# EasyEDA Pro project ProPrj_Framethrower_Denise_Rev1.epro

# Schematic Schematic1
Board Name: Board1; Create Date: 2025-08-25; Page Name: P1; Project Name: Framethrower_Denise_2; Schematic Name: Schematic1; Update Date: 2025-08-30; Company: EasyEDA.com; Page Size: A4; Version: V1.0
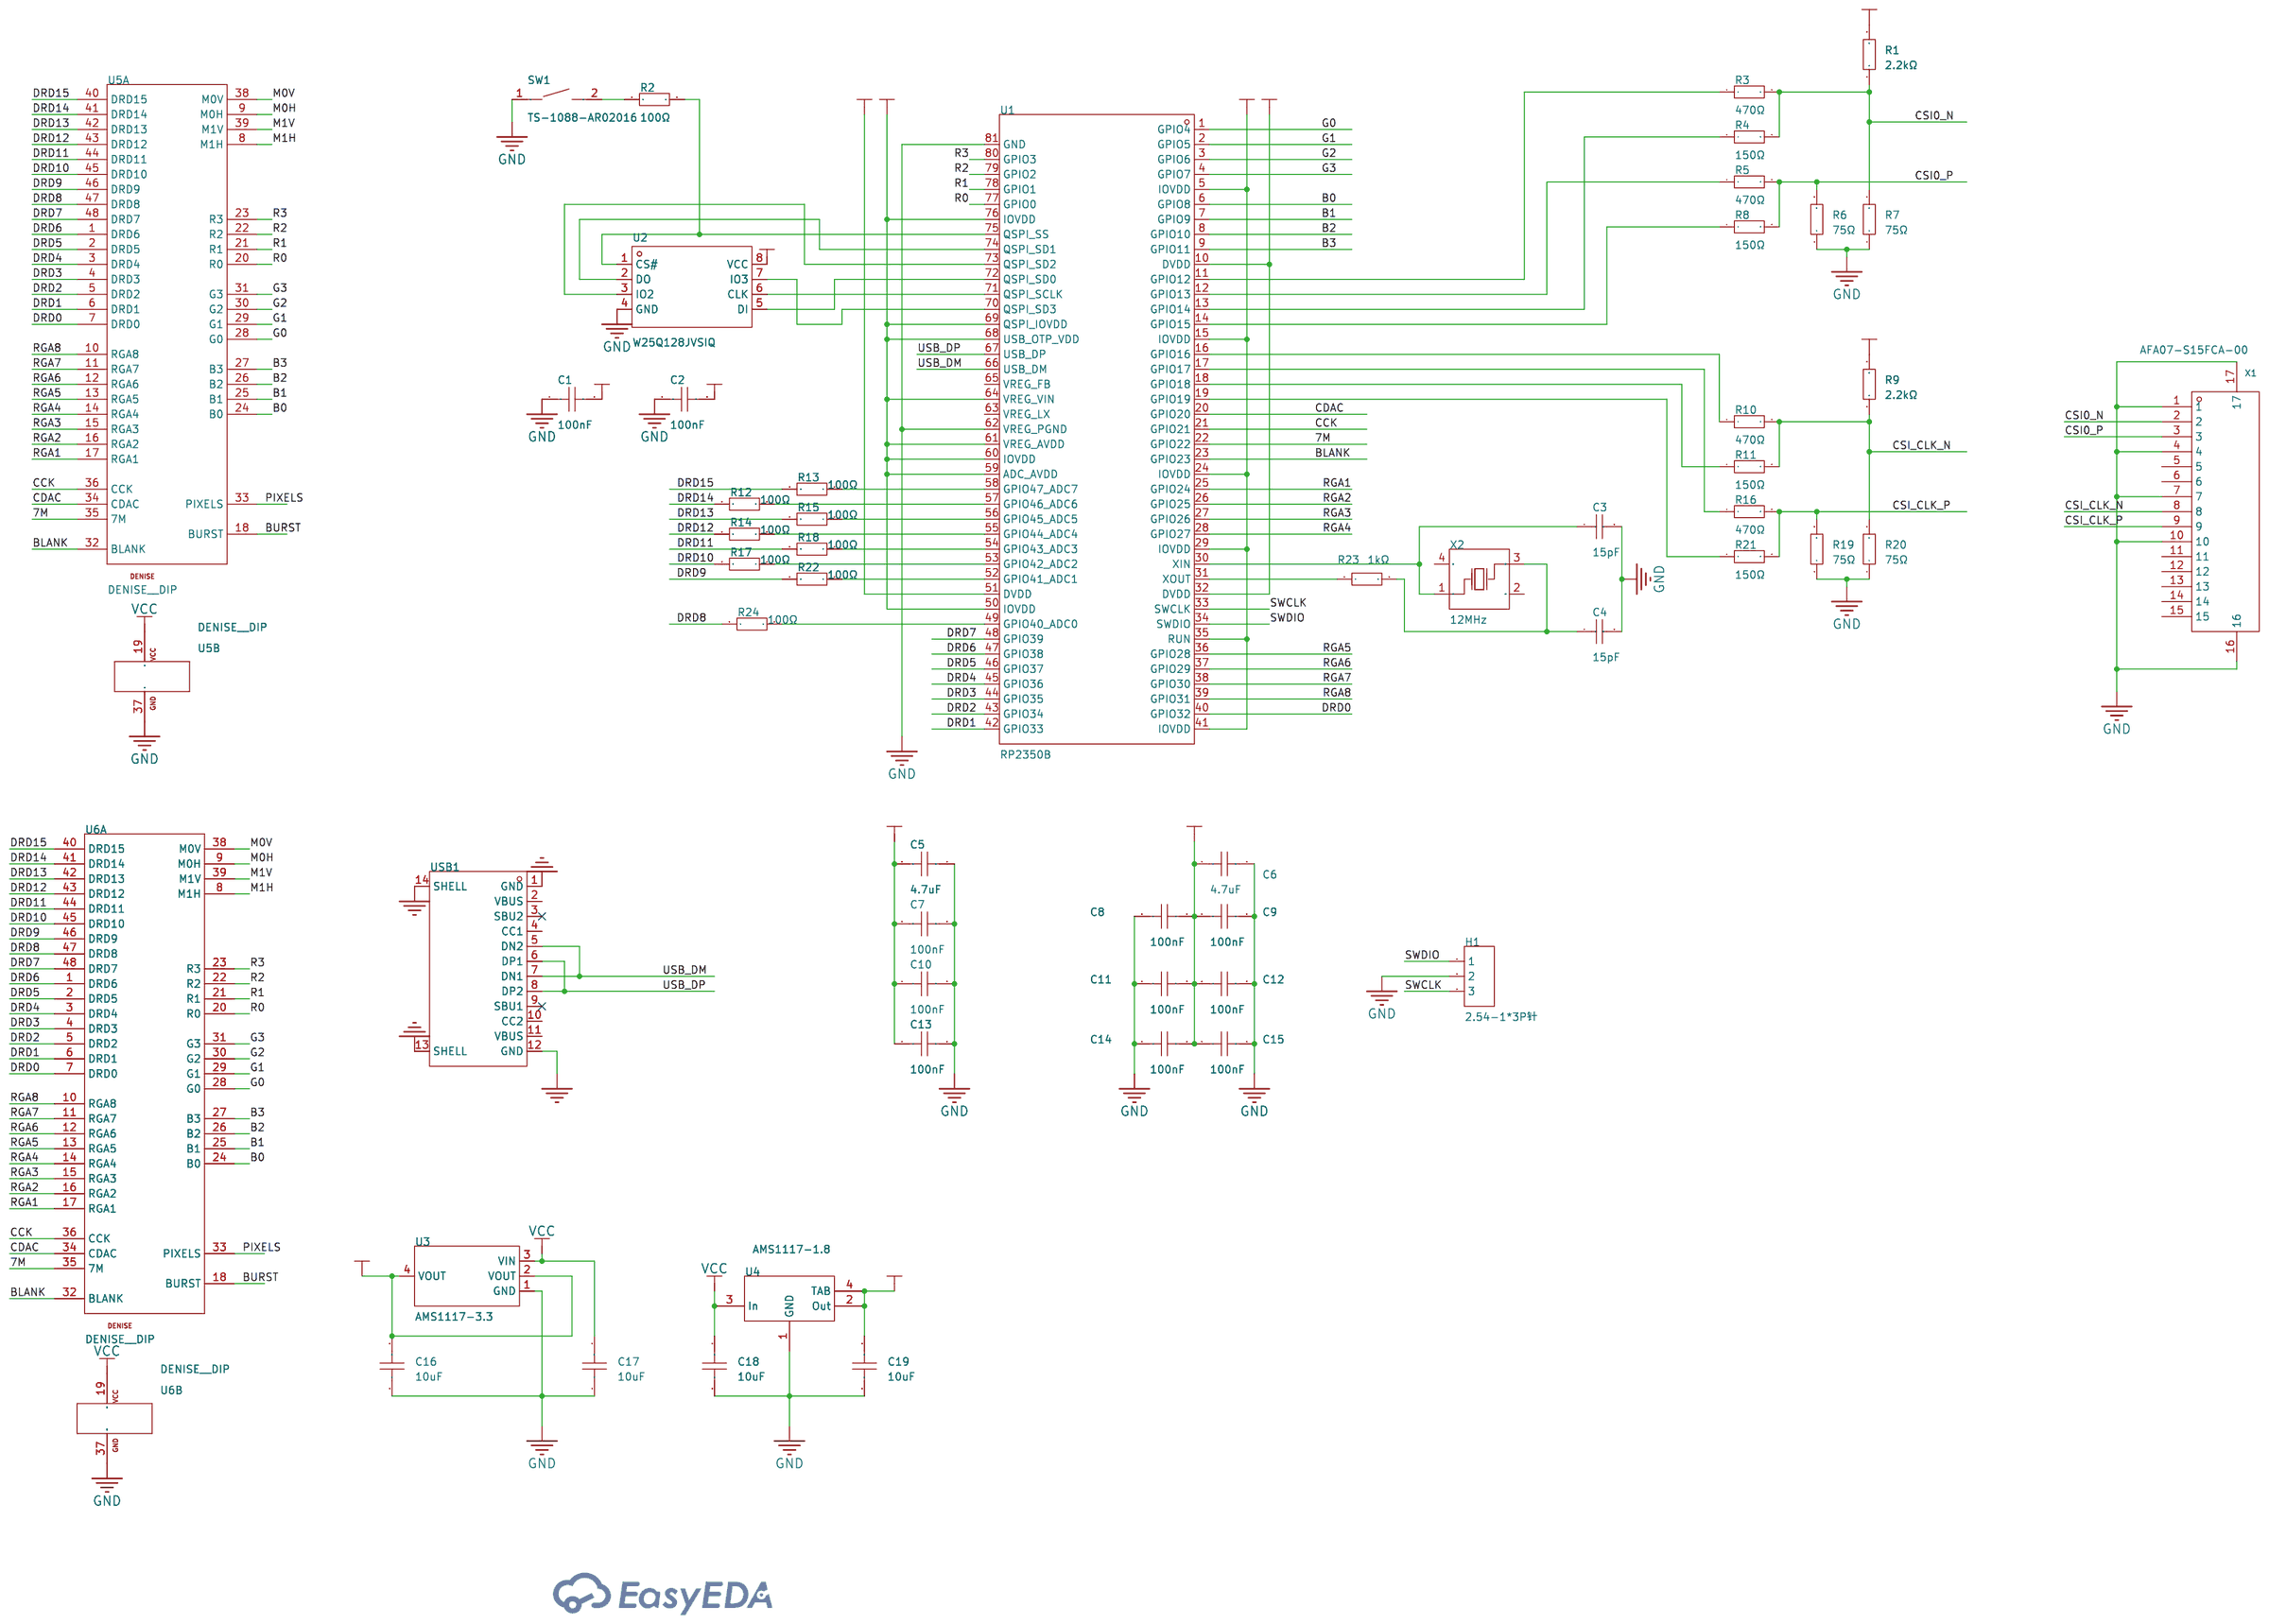
[diagram p0: schematic sheet]

## Parts
C1  100nF  [C0603]
C2  100nF  [C0603]
C3  15pF  [C0603]
C4  15pF  [C0603]
C5  4.7uF  [C0603]
C6  4.7uF  [C0603]
C7  100nF  [C0603]
C8  100nF  [C0603]
C9  100nF  [C0603]
C10  100nF  [C0603]
C11  100nF  [C0603]
C12  100nF  [C0603]
C13  100nF  [C0603]
C14  100nF  [C0603]
C15  100nF  [C0603]
C16  10uF  [C0603]
C17  10uF  [C0603]
C18  10uF  [C0603]
C19  10uF  [C0603]
H1  2.54-1*3P针  [HDR-TH_3P-P2.54-V-M-1]  (no BOM)
R1  2.2kΩ  [R0603]
R2  100Ω  [R0603]
R3  470Ω  [R0603]
R4  150Ω  [R0603]
R5  470Ω  [R0603]
R6  75Ω  [R0603]
R7  75Ω  [R0603]
R8  150Ω  [R0603]
R9  2.2kΩ  [R0603]
R10  470Ω  [R0603]
R11  150Ω  [R0603]
R12  100Ω  [R0603]
R13  100Ω  [R0603]
R14  100Ω  [R0603]
R15  100Ω  [R0603]
R16  470Ω  [R0603]
R17  100Ω  [R0603]
R18  100Ω  [R0603]
R19  75Ω  [R0603]
R20  75Ω  [R0603]
R21  150Ω  [R0603]
R22  100Ω  [R0603]
R23  1kΩ  [R0603]
R24  100Ω  [R0603]
SW1  TS-1088-AR02016  [SW-SMD_L3.9-W3.0-P4.45]
U1  RP2350B  [QFN-80_L10.0-W10.0-P0.40-TL-EP3.4]
U2  W25Q128JVSIQ  [SOIC-8_L5.3-W5.3-P1.27-LS8.0-BL]
U3  AMS1117-3.3  [SOT-223-3_L6.5-W3.4-P2.30-LS7.0-BR]
U4  AMS1117-1.8  [SOT-223-4_L6.5-W3.5-P2.30-LS7.0-BR]
U5  DENISE__DIP  [DIP48-6]  (sections G$1,PWR)
U6  DENISE__DIP  [DIP48-6]  (sections G$1,PWR)
USB1  TYPE-C 16PIN 2MD(073)  [USB-C-SMD_TYPE-C-6PIN-2MD-073]
X1  AFA07-S15FCA-00  [FPC-SMD_15P-P1.00_JS_AFA07-S15XXX]
X2  12MHz  [CRYSTAL-SMD_4P-L3.2-W2.5-BL]

## Library data of the parts
C1 C2 C7-C15 = CC0603KRX7R9BB104: Capacitance:100nF Tolerance:±10% Tolerance:±10% Voltage Rating:50V Temperature Coefficient:X7R; LCSC Part Name: 100nF ±10% 50V; Supplier Part: C14663; Manufacturer: YAGEO(国巨); Supplier Footprint: 0603; JLCPCB Part Class: Basic Part; Datasheet: https://atta.szlcsc.com/upload/public/pdf/source/20180910/C282072_33301C7F631E79921B82A8DAC6BCC5B3.pdf; Supplier: LCSC; Tolerance: ±10%; Voltage Rating: 50V; Temperature Coefficient: X7R
C3 C4 = CL10C150JB8NNNC: Capacitance: Tolerance:±5% Tolerance:±5% Voltage Rated: Temperature Coefficient:; LCSC Part Name: 15pF ±5% 50V; Supplier Part: C1644; Manufacturer: SAMSUNG(三星); Supplier Footprint: 0603; JLCPCB Part Class: Basic Part; Datasheet: https://atta.szlcsc.com/upload/public/pdf/source/20160218/1457707763339.pdf; Supplier: LCSC; Tolerance: ±5%
C5 C6 = CL10A475KO8NNNC: Capacitance: Tolerance:±10% Tolerance:±10% Voltage Rated: Temperature Coefficient:; LCSC Part Name: 4.7uF ±10% 16V; Supplier Part: C19666; Manufacturer: SAMSUNG(三星); Supplier Footprint: 0603; JLCPCB Part Class: Basic Part; Datasheet: https://atta.szlcsc.com/upload/public/pdf/source/20160218/1457707763339.pdf; Supplier: LCSC; Tolerance: ±10%
C16-C19 = CL10A106KP8NNNC: Capacitance: Tolerance:±10% Tolerance:±10% Voltage Rated: Temperature Coefficient:; LCSC Part Name: 10uF ±10% 10V; Supplier Part: C19702; Manufacturer: SAMSUNG(三星); Supplier Footprint: 0603; JLCPCB Part Class: Basic Part; Datasheet: https://atta.szlcsc.com/upload/public/pdf/source/20160218/1457707763339.pdf; Supplier: LCSC; Tolerance: ±10%
H1 = 2.54-1*3P针: Pin Structure:1x3P Pitch:2.54mm Row Spacing:- Circluar Pins/Square Pins:Policy Mounting Type:Direct Insert Number of Rows:Single Row Number of Pins:3P Current Rating (Max):3A Voltage Rating (Max):- Length of Mating Pin:- Insulation Height:- Length of End; LCSC Part Name: 间距:2.54mm 1x3P 直插 方针; Supplier Part: C49257; Manufacturer: BOOMELE(博穆精密); Supplier Footprint: 插件,P=2.54mm; JLCPCB Part Class: Extended Part; Datasheet: https://atta.szlcsc.com/upload/public/pdf/source/20221018/3E9408392E35E6F57A28985E5F7BF5C9.pdf; Supplier: LCSC; Pin Structure: 1x3P; Pitch: 2.54mm; Circluar Pins/Square Pins: Policy; Mounting Type: Direct Insert; Number of Rows: Single Row; Number of Pins: 3P; Current Rating (Max): 3A; Operating Temperature Range: -40℃~+105℃; Color: Black
R1 R9 = 0603WAF2201T5E_C4190: Type:Thick Film Resistors Resistance:2.2kΩ Tolerance:±1% Tolerance:±1% Power(Watts): Overload Voltage (Max): Temperature Coefficient:±100ppm/℃ Temperature Coefficient:±100ppm/℃ Operating Temperature Range:-55℃~+155℃ Operating Temperature Range:-55℃~+155℃; LCSC Part Name: 2.2kΩ ±1% 100mW 厚膜电阻; Supplier Part: C4190; Manufacturer: UNI-ROYAL(厚声); Manufacturer Part: 0603WAF2201T5E; Supplier Footprint: 0603; JLCPCB Part Class: Basic Part; Datasheet: https://atta.szlcsc.com/upload/public/pdf/source/20200306/C422600_1E6D84923E4A46A82E41ADD87F860B5C.pdf; Supplier: LCSC; Type: Thick Film Resistors; Tolerance: ±1%; Temperature Coefficient: ±100ppm/℃; Operating Temperature Range: -55℃~+155℃
R2 R12-R15 R17 R18 R22 R24 = 0603WAF1000T5E: Type:Thick Film Resistors Resistance: Tolerance:±1% Tolerance:±1% Power(Watts): Overload Voltage (Max): Temperature Coefficient:±200ppm/℃ Temperature Coefficient:±200ppm/℃ Operating Temperature Range:-55℃~+155℃ Operating Temperature Range:-55℃~+155℃; LCSC Part Name: 100Ω ±1% 100mW 厚膜电阻; Supplier Part: C22775; Manufacturer: UNI-ROYAL(厚声); Supplier Footprint: 0603; JLCPCB Part Class: Basic Part; Datasheet: https://atta.szlcsc.com/upload/public/pdf/source/20200306/C422600_1E6D84923E4A46A82E41ADD87F860B5C.pdf; Supplier: LCSC; Type: Thick Film Resistors; Tolerance: ±1%; Temperature Coefficient: ±200ppm/℃; Operating Temperature Range: -55℃~+155℃
R3 R5 R10 R16 = 0603WAF4700T5E: Type:Thick Film Resistor Resistance:470Ω Tolerance:±1% Tolerance:±1% Power(Watts):100mW Voltage-Supply(Max):75V Temperature Coefficient:±100ppm/℃ Temperature Coefficient:±100ppm/℃ Operating Temperature:-55℃~+155℃ Operating Temperature:-55℃~+155℃; LCSC Part Name: 470Ω ±1% 100mW 厚膜电阻; Supplier Part: C23179; Manufacturer: UNI-ROYAL(厚声); Supplier Footprint: 0603; JLCPCB Part Class: Basic Part; Datasheet: https://item.szlcsc.com/datasheet/0603WAF4700T5E/23906.html; Supplier: LCSC; Type: Thick Film Resistor; Tolerance: ±1%; Power(Watts): 100mW; Voltage-Supply(Max): 75V; Temperature Coefficient: ±100ppm/℃; Operating Temperature: -55℃~+155℃
R4 R8 R11 R21 = 0603WAF1500T5E: Type:Thick Film Resistors Resistance: Tolerance:±1% Tolerance:±1% Power(Watts): Overload Voltage (Max): Temperature Coefficient:±100ppm/℃ Temperature Coefficient:±100ppm/℃ Operating Temperature Range:-55℃~+155℃ Operating Temperature Range:-55℃~+155℃; LCSC Part Name: 150Ω ±1% 100mW 厚膜电阻; Supplier Part: C22808; Manufacturer: UNI-ROYAL(厚声); Supplier Footprint: 0603; JLCPCB Part Class: Basic Part; Datasheet: https://atta.szlcsc.com/upload/public/pdf/source/20200306/C422600_1E6D84923E4A46A82E41ADD87F860B5C.pdf; Supplier: LCSC; Type: Thick Film Resistors; Tolerance: ±1%; Temperature Coefficient: ±100ppm/℃; Operating Temperature Range: -55℃~+155℃
R6 R7 R19 R20 = 0603WAF750JT5E: Type:Thick Film Resistor Resistance:75Ω Tolerance:±1% Tolerance:±1% Power(Watts):100mW Voltage-Supply(Max):75V Temperature Coefficient:±100ppm/℃ Temperature Coefficient:±100ppm/℃ Operating Temperature:-55℃~+155℃ Operating Temperature:-55℃~+155℃; LCSC Part Name: 75Ω ±1% 100mW 厚膜电阻; Supplier Part: C4275; Manufacturer: UNI-ROYAL(厚声); Supplier Footprint: 0603; JLCPCB Part Class: Basic Part; Datasheet: https://item.szlcsc.com/datasheet/0603WAF750JT5E/4682.html; Supplier: LCSC; Type: Thick Film Resistor; Tolerance: ±1%; Power(Watts): 100mW; Temperature Coefficient: ±100ppm/℃; Operating Temperature Range: -55℃~+155℃; Voltage-Supply(Max): 75V; Operating Temperature: -55℃~+155℃
R23 = 0603WAF1001T5E: Type:Thick Film Resistors Resistance:1kΩ Tolerance:±1% Tolerance:±1% Power(Watts): Overload Voltage (Max): Temperature Coefficient:±100ppm/℃ Temperature Coefficient:±100ppm/℃ Operating Temperature Range:-55℃~+155℃ Operating Temperature Range:-55℃~+155℃; LCSC Part Name: 1kΩ ±1% 100mW 厚膜电阻; Supplier Part: C21190; Manufacturer: UNI-ROYAL(厚声); Supplier Footprint: 0603; JLCPCB Part Class: Basic Part; Datasheet: https://atta.szlcsc.com/upload/public/pdf/source/20200306/C422600_1E6D84923E4A46A82E41ADD87F860B5C.pdf; Supplier: LCSC; Type: Thick Film Resistors; Tolerance: ±1%; Temperature Coefficient: ±100ppm/℃; Operating Temperature Range: -55℃~+155℃
SW1 = TS-1088-AR02016: Circuit:SPST Actuator Style:Round Button Operating Force:160gf Mounting Style:Brick nogging Switch Length:4mm Switch Width:3mm Switch Height:2mm Strike Gundam:不带 Contact Current:50mA Voltage Rating (DC):12V Insulation Resistance:100MΩ Actuator/Cap Color:B; LCSC Part Name: 4*3*2mm 立贴 轻触开关; Supplier Part: C720477; Manufacturer: XUNPU(讯普); Supplier Footprint: SMD; JLCPCB Part Class: Basic Part; Datasheet: https://atta.szlcsc.com/upload/public/pdf/source/20200810/C720475_60D09DD6C54279ADDB2DC25100F1CC11.pdf; Supplier: LCSC; Circuit: SPST; Actuator Style: Round Button; Operating Force: 160gf; Mounting Style: Brick nogging; Switch Length: 4mm; Switch Width: 3mm; Switch Height: 2mm; Strike Gundam: 不带; Contact Current: 50mA; Voltage Rating (DC): 12V; Insulation Resistance: 100MΩ; Actuator/Cap Color: Black; Pin Style: SMDSplicing; Mechanical Life: 10万次; Operating Temperature: -30℃~+80℃
U1 = RP2350B_C42415655: Supplier Part: C42415655; Manufacturer: Raspberry Pi(树莓派); Supplier Footprint: QFN-80-EP(10x10); JLCPCB Part Class: Extended Part; Datasheet: https://atta.szlcsc.com/upload/public/pdf/source/20241210/0989AB86AAD7A21936E5CD12ADC9EA29.pdf; Supplier: LCSC
U2 = W25Q128JVSIQ: Interface Type:SPI Memory Size:128Mbit Clock Frequency (fc):133MHz Supply Voltage:2.7V~3.6V Supply Voltage:2.7V~3.6V Page Programming Time (Tpp):700us Block Erase Time (tBE):120ms@(32KB) Data Retention - TDR (Year):20 years Operating Temperature:-40℃~+85℃; LCSC Part Name: W25Q128JVSIQ 编带; Supplier Part: C97521; Manufacturer: WINBOND(华邦); Supplier Footprint: SOIC-8-208mil; JLCPCB Part Class: Basic Part; Datasheet: https://atta.szlcsc.com/upload/public/pdf/source/20170316/1489627409956.pdf; Supplier: LCSC; Interface Type: SPI; Memory Size: 128Mbit; Clock Frequency (fc): 133MHz; Supply Voltage: 2.7V~3.6V; Page Programming Time (Tpp): 700us; Block Erase Time (tBE): 120ms@(32KB); Data Retention - TDR (Year): 20 years; Operating Temperature: -40℃~+85℃
U3 = AMS1117-3.3_C6186: Output Type:Fixed Voltage - Supply:16V Output Voltage:3.3V Output Voltage:3.3V Output Current:1A Power Supply Rejection Ratio (PSRR):72dB@(120Hz) Voltage Dropout:1.1V@(800mA) standby current:5mA Noise:- Features:Over Current Protection；Over Temperature Pr; LCSC Part Name: 输出3.3V 1A; Supplier Part: C6186; Manufacturer: AMS; Supplier Footprint: SOT-223; JLCPCB Part Class: Basic Part; Datasheet: https://atta.szlcsc.com/upload/public/pdf/source/20180727/C6186_7A095716F0823C02F1997A905E26C086.pdf; Supplier: LCSC; Output Type: Fixed; Voltage - Supply: 16V; Output Voltage: 3.3V; Output Current: 1A; Power Supply Rejection Ratio (PSRR): 72dB@(120Hz); Voltage Dropout: 1.1V@(800mA); standby current: 5mA; Features: Over Current Protection；Over Temperature Protection; Operating Temperature: -40℃~+125℃; Output Configuration: Positive; Number of Outputs: 1
U4 = AMS1117-1.8_C6185: Output Type:Fixed Voltage - Supply:15V Output Voltage:1.8V Output Voltage:1.8V Output Current:1A Power Supply Rejection Ratio (PSRR):75dB@(120Hz) Voltage Dropout:1.3V@(1A) Output Configuration:Positive electrode Number of Outputs:1; LCSC Part Name: 输入15V 输出1.8V 1A; Supplier Part: C6185; Manufacturer: AMS; Supplier Footprint: SOT-223; JLCPCB Part Class: Extended Part; Datasheet: https://atta.szlcsc.com/upload/public/pdf/source/20180727/C6186_7A095716F0823C02F1997A905E26C086.pdf; Supplier: LCSC; Output Type: Fixed; Voltage - Supply: 15V; Output Voltage: 1.8V; Output Current: 1A; Power Supply Rejection Ratio (PSRR): 75dB@(120Hz); Voltage Dropout: 1.3V@(1A); Output Configuration: Positive electrode; Number of Outputs: 1
U5 U6 = DENISE__DIP
USB1 = TYPE-C 16PIN 2MD(073): 连接器类型:Type-C;标准:-;公母:母;端口数量:1;触点数量:16P;安装方式:卧贴;额定电流 - 电源:5A;工作温度范围:-25℃~+85℃;; LCSC Part Name: Type-C 母 卧贴; Supplier Part: C2765186; Manufacturer: SHOU HAN(首韩); Supplier Footprint: SMD; JLCPCB Part Class: 扩展库; Datasheet: https://atta.szlcsc.com/upload/public/pdf/source/20211123/39B17C16241EAC15C5E277BDA434118E.pdf; Supplier: LCSC; Connector Type: Type-C; Gender: 母; Number of Ports: 1; Number of Contacts: 16P; Mounting Style: 卧贴; Current Rating - Power (Max): 5A; Operating Temperature Range: -25℃~+85℃
X1 = AFA07-S15FCA-00: Locking Feature:抽屉式 Contact Type:Bottom Contact Number of Contacts:15P Pitch:1mm Mounting Type:卧贴 FFC, FCB Thickness:0.3mm FFC, FCB Thickness:0.3mm Height Above Board:2.5mm Operating Temperature Range:- Operating Temperature Range:-; LCSC Part Name: 间距:1mm P数:15P 抽屉式 下接; Supplier Part: C262721; Manufacturer: JS(钜硕电子); Supplier Footprint: SMD,P=1mm,卧贴; JLCPCB Part Class: Extended Part; Datasheet: https://atta.szlcsc.com/upload/public/pdf/source/20191217/C262716_30B15E9A77BFCA4A54741C92DB3BE8CC.pdf; Supplier: LCSC; Locking Feature: 抽屉式; Contact Type: Bottom Contact; Number of Contacts: 15P; Pitch: 1mm; Mounting Type: 卧贴; FFC, FCB Thickness: 0.3mm; Height Above Board: 2.5mm
X2 = X322512MSB4SI: Type:Surface Mount Crystal Frequency:12MHz Normal temperature Frequency Tolerance:±10ppm Normal temperature Frequency Tolerance:±10ppm Load Capacitance:20pF Frequency Stability:±20ppm Frequency Stability:±20ppm Operating Temperature:-40℃~+85℃ Operating Te; LCSC Part Name: YSX321SL 12MHZ 4P 3225 20PF ±10PPM -40~85℃ (±20PPM); Supplier Part: C9002; Manufacturer: YXC(扬兴晶振); Supplier Footprint: SMD3225-4P; JLCPCB Part Class: Basic Part; Datasheet: https://atta.szlcsc.com/upload/public/pdf/source/20240329/19D5F850207469550BEB00D7DFEDBC7A.pdf; Supplier: LCSC; Type: Surface Mount Crystal; Normal temperature Frequency Tolerance: ±10ppm; Load Capacitance: 20pF; Frequency Stability: ±20ppm; Operating Temperature: -40℃~+85℃

## Nets
GND: C1.1 C2.1 C3.2 C4.2 C5.2 C6.2 C7.2 C8.1 C9.2 C10.2 C11.1 C12.2 C13.2 C14.1 C15.2 C16.1 C17.1 C18.1 C19.1 H1.2 R6.1 R7.1 R19.1 R20.1 SW1.1 U1.62(VREG_PGND) U1.81(GND) U2.4(GND) U3.1(GND) U4.1(GND) U5.37(GND1) U6.37(GND1) USB1.1(GND) USB1.12(GND) USB1.13(SHELL) USB1.14(SHELL) X1.1 X1.4 X1.7 X1.10 X1.16 X1.17
VCC: C17.2 C18.2 U3.3(VIN) U4.3(In) U5.19(VCC1) U6.19(VCC1)
VCC18: C5.1 C7.1 C10.1 C13.1 C19.2 U1.10(DVDD) U1.32(DVDD) U1.51(DVDD) U4.2(Out) U4.4(TAB)
VCC33: C1.2 C2.2 C6.1 C8.2 C9.1 C11.2 C12.1 C14.2 C15.1 C16.2 R1.2 R9.2 U1.5(IOVDD) U1.15(IOVDD) U1.24(IOVDD) U1.29(IOVDD) U1.35(RUN) U1.41(IOVDD) U1.50(IOVDD) U1.59(ADC_AVDD) U1.60(IOVDD) U1.61(VREG_AVDD) U1.64(VREG_VIN) U1.68(USB_OTP_VDD) U1.69(QSPI_IOVDD) U1.76(IOVDD) U2.8(VCC) U3.2(VOUT) U3.4(VOUT)
7M: U1.22(GPIO22) U5.35(7M) U6.35(7M)
B0: U1.6(GPIO8) U5.24(B0) U6.24(B0)
B1: U1.7(GPIO9) U5.25(B1) U6.25(B1)
B2: U1.8(GPIO10) U5.26(B2) U6.26(B2)
B3: U1.9(GPIO11) U5.27(B3) U6.27(B3)
BLANK: U1.23(GPIO23) U5.32(BLANK) U6.32(BLANK)
BURST: U5.18(BURST) U6.18(BURST)
CCK: U1.21(GPIO21) U5.36(CCK) U6.36(CCK)
CDAC: U1.20(GPIO20) U5.34(CDAC) U6.34(CDAC)
CSI0_N: R1.1 R3.2 R4.2 R7.2 X1.2
CSI0_P: R5.2 R6.2 R8.2 X1.3
CSI_CLK_N: R9.1 R10.2 R11.2 R20.2 X1.8
CSI_CLK_P: R16.2 R19.2 R21.2 X1.9
DRD0: U1.40(GPIO32) U5.7(DRD0) U6.7(DRD0)
DRD1: U1.42(GPIO33) U5.6(DRD1) U6.6(DRD1)
DRD2: U1.43(GPIO34) U5.5(DRD2) U6.5(DRD2)
DRD3: U1.44(GPIO35) U5.4(DRD3) U6.4(DRD3)
DRD4: U1.45(GPIO36) U5.3(DRD4) U6.3(DRD4)
DRD5: U1.46(GPIO37) U5.2(DRD5) U6.2(DRD5)
DRD6: U1.47(GPIO38) U5.1(DRD6) U6.1(DRD6)
DRD7: U1.48(GPIO39) U5.48(DRD7) U6.48(DRD7)
DRD8: R24.2 U5.47(DRD8) U6.47(DRD8)
DRD9: R22.2 U5.46(DRD9) U6.46(DRD9)
DRD10: R17.2 U5.45(DRD10) U6.45(DRD10)
DRD11: R18.2 U5.44(DRD11) U6.44(DRD11)
DRD12: R14.2 U5.43(DRD12) U6.43(DRD12)
DRD13: R15.2 U5.42(DRD13) U6.42(DRD13)
DRD14: R12.2 U5.41(DRD14) U6.41(DRD14)
DRD15: R13.2 U5.40(DRD15) U6.40(DRD15)
G0: U1.1(GPIO4) U5.28(G0) U6.28(G0)
G1: U1.2(GPIO5) U5.29(G1) U6.29(G1)
G2: U1.3(GPIO6) U5.30(G2) U6.30(G2)
G3: U1.4(GPIO7) U5.31(G3) U6.31(G3)
M0H: U5.9(M0H) U6.9(M0H)
M0V: U5.38(M0V) U6.38(M0V)
M1H: U5.8(M1H) U6.8(M1H)
M1V: U5.39(M1V) U6.39(M1V)
PIXELS: U5.33(PIXELS) U6.33(PIXELS)
R0: U1.77(GPIO0) U5.20(R0) U6.20(R0)
R1: U1.78(GPIO1) U5.21(R1) U6.21(R1)
R2: U1.79(GPIO2) U5.22(R2) U6.22(R2)
R3: U1.80(GPIO3) U5.23(R3) U6.23(R3)
RGA1: U1.25(GPIO24) U5.17(RGA1) U6.17(RGA1)
RGA2: U1.26(GPIO25) U5.16(RGA2) U6.16(RGA2)
RGA3: U1.27(GPIO26) U5.15(RGA3) U6.15(RGA3)
RGA4: U1.28(GPIO27) U5.14(RGA4) U6.14(RGA4)
RGA5: U1.36(GPIO28) U5.13(RGA5) U6.13(RGA5)
RGA6: U1.37(GPIO29) U5.12(RGA6) U6.12(RGA6)
RGA7: U1.38(GPIO30) U5.11(RGA7) U6.11(RGA7)
RGA8: U1.39(GPIO31) U5.10(RGA8) U6.10(RGA8)
SWCLK: H1.3 U1.33(SWCLK)
SWDIO: H1.1 U1.34(SWDIO)
USB_DM: U1.66(USB_DM) USB1.5(DN2) USB1.7(DN1)
USB_DP: U1.67(USB_DP) USB1.6(DP1) USB1.8(DP2)
$1N6285: R14.1 U1.55(GPIO44_ADC4)
$1N6288: R18.1 U1.54(GPIO43_ADC3)
$1N6291: R17.1 U1.53(GPIO42_ADC2)
$1N6294: R22.1 U1.52(GPIO41_ADC1)
$1N6300: R12.1 U1.57(GPIO46_ADC6)
$1N6303: R15.1 U1.56(GPIO45_ADC5)
$1N6306: R13.1 U1.58(GPIO47_ADC7)
$1N7209: R24.1 U1.49(GPIO40_ADC0)
$1N7218: R3.1 U1.11(GPIO12)
$1N7223: R5.1 U1.12(GPIO13)
$1N7228: R4.1 U1.13(GPIO14)
$1N7233: R8.1 U1.14(GPIO15)
$1N7238: R10.1 U1.16(GPIO16)
$1N7248: R11.1 U1.18(GPIO18)
$1N7253: R21.1 U1.19(GPIO19)
$1N7405: U1.71(QSPI_SCLK) U2.6(CLK)
$1N7416: R2.1 U1.75(QSPI_SS) U2.1(CS#)
$1N7425: U1.74(QSPI_SD1) U2.2(DO)
$1N7453: C3.1 U1.30(XIN) X2.1(OSC1)
$1N8305: U1.72(QSPI_SD0) U2.5(DI)
$1N8365: U1.70(QSPI_SD3) U2.7(IO3)
$1N8373: U1.73(QSPI_SD2) U2.3(IO2)
$1N9901: R23.1 U1.31(XOUT)
$1N9909: C4.1 R23.2 X2.3(OSC2)
$1N12175: R2.2 SW1.2
$1N13618: R16.1 U1.17(GPIO17)

Not connected (* = marked no-connect by the designer): U1 63(VREG_LX) 65(VREG_FB); USB1 2(VBUS) 3(SBU2)* 4(CC1) 9(SBU1)* 10(CC2) 11(VBUS); X1 5 6 11 12 13 14 15; X2 2(GND) 4(GND)

# Board PCB1
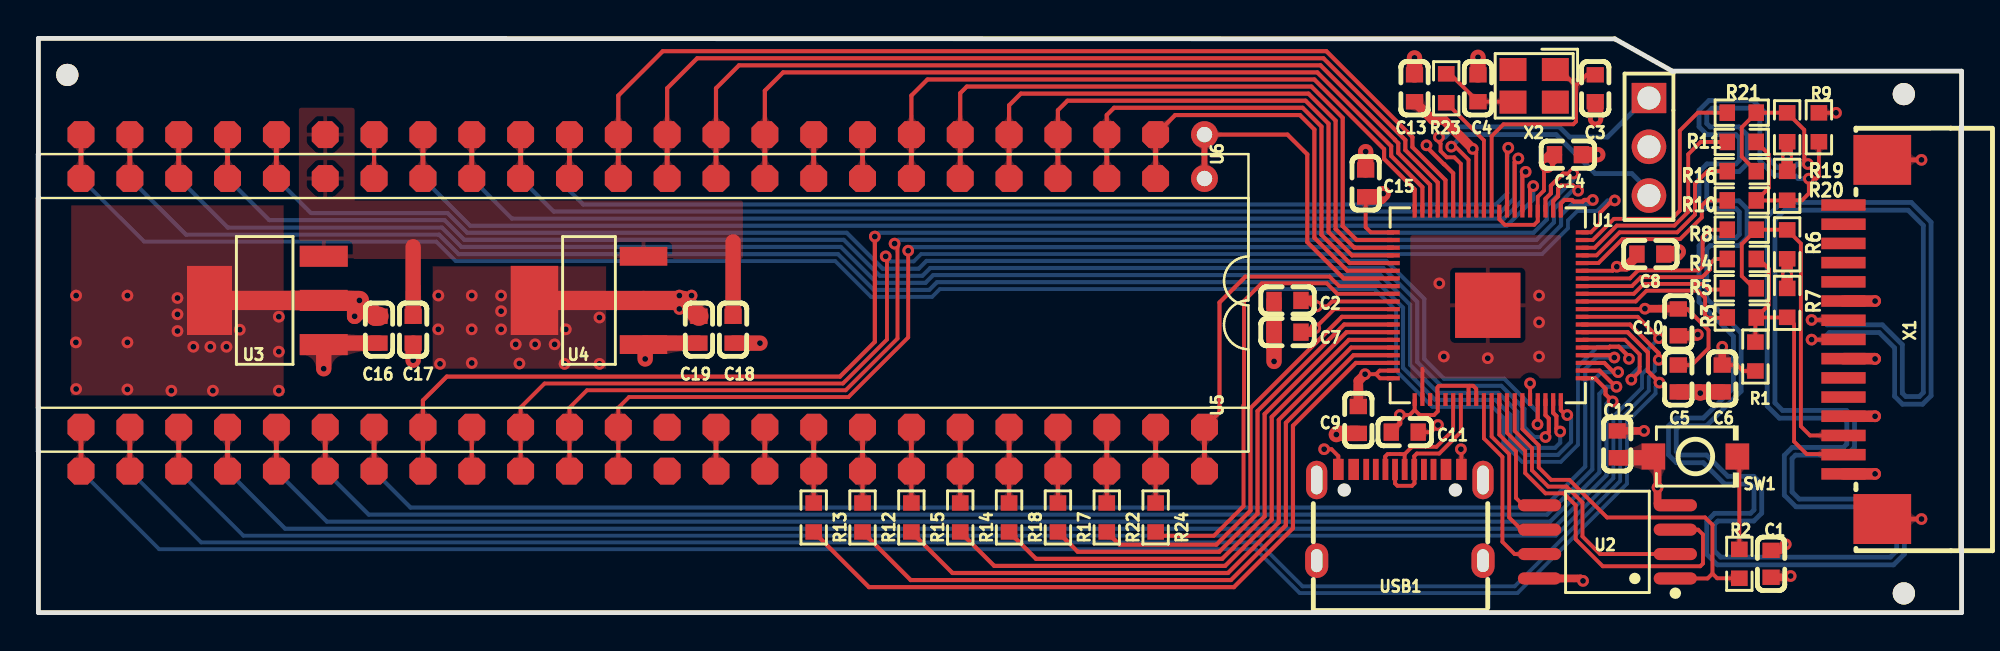
[diagram p1: board, top side]
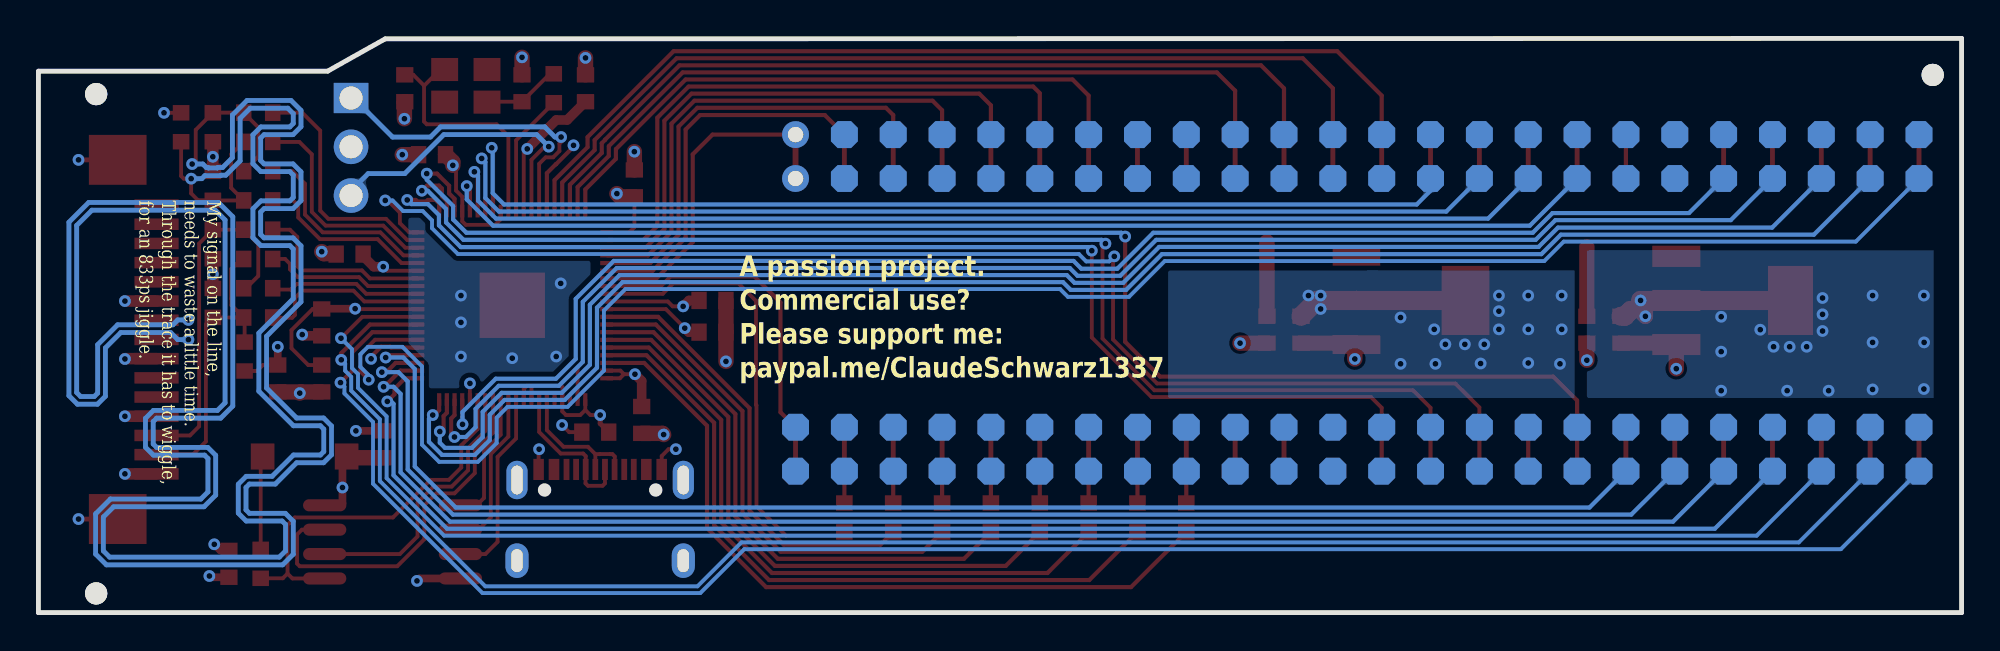
[diagram p2: board, bottom side, seen from below]

Outline 100 x 29.9 mm; copper layers: Top Layer, Inner1, Inner2, Bottom Layer. Coordinates in mm from the lower left corner of the outline.
Outline path: 0,29.9 81.97,29.88 84.97,28.19 100,28.19 100,0 0,0 0,29.9
Stack: Top Layer 0.035mm Outer layer thickness 1oz / Dielectric1 0.2104mm 7628 RC49% 8.6mil / Inner1 0.0152mm Inner layer thickness / Dielectric2 1.065mm 1.1mm H/HOZ Copper / Inner2 0.0152mm Inner layer thickness / Dielectric3 0.2104mm 7628 RC49% 8.6mil / Bottom Layer 0.035mm Outer layer thickness 1oz

## Design rules (mm)
net CSI_CLK_P: DP1
net CSI_CLK_N: DP1
template: Custom Config
spacing copperThickness1oz (default): track to track 0.152, other pairs 0.152 to 0.3
spacing copperThickness2oz: track to track 0.203, other pairs 0.152 to 0.3
track width copperThickness1oz (default): min 0.127, default 0.254, max 2.54
track width copperThickness2oz: min 0.203, default 0.254, max 2.54
differential pair differentialPair (default): width min 0.127, default 0.254, max 2.54; gap min 0.152, default 0.152
via viaSize (default): diameter min 0.5, default 0.61, max 10; hole min 0.3, default 0.305, max 6.3

## Placement (name value [footprint] x y rotation side)
C1  100nF  [C0603]  90.1 2.54 90 top
C2  100nF  [C0603]  64.95 16.26 0 top
C3  15pF  [C0603]  80.95 27.31 270 top
C4  15pF  [C0603]  74.86 27.31 90 top
C5  4.7uF  [C0603]  85.27 12.19 270 top
C6  4.7uF  [C0603]  87.56 12.19 270 top
C7  100nF  [C0603]  64.95 14.61 180 top
C8  100nF  [C0603]  83.82 18.67 180 top
C9  100nF  [C0603]  68.63 10.03 270 top
C10  100nF  [C0603]  85.27 15.11 270 top
C11  100nF  [C0603]  71.05 9.4 180 top
C12  100nF  [C0603]  82.09 8.76 270 top
C13  100nF  [C0603]  71.55 27.31 90 top
C14  100nF  [C0603]  79.53 23.85 180 top
C15  100nF  [C0603]  69.01 22.35 90 top
C16  10uF  [C0603]  17.71 14.73 90 top
C17  10uF  [C0603]  19.48 14.73 90 top
C18  10uF  [C0603]  36.12 14.73 90 top
C19  10uF  [C0603]  34.34 14.73 90 top
H1  2.54-1*3P针  [HDR-TH_3P-P2.54-V-M-1]  83.75 24.26 270 top
NOREF  -  [Pad_e57]  1.5 28 0 top
NOREF#2  -  [Pad_e38]  97 1 0 top
NOREF#3  -  [Pad_e58]  97 27 0 top
R1  2.2kΩ  [R0603]  89.28 13.34 270 top
R2  100Ω  [R0603]  88.44 2.54 90 top
R3  470Ω  [R0603]  88.57 15.37 0 top
R4  150Ω  [R0603]  88.57 18.42 0 top
R5  470Ω  [R0603]  88.57 16.89 0 top
R6  75Ω  [R0603]  90.93 19.18 90 top
R7  75Ω  [R0603]  90.93 16.13 270 top
R8  150Ω  [R0603]  88.57 19.94 0 top
R9  2.2kΩ  [R0603]  92.58 25.27 90 top
R10  470Ω  [R0603]  88.57 21.46 0 top
R11  150Ω  [R0603]  88.57 24.51 0 top
R12  100Ω  [R0603]  42.85 4.95 90 top
R13  100Ω  [R0603]  40.31 4.95 90 top
R14  100Ω  [R0603]  47.93 4.95 90 top
R15  100Ω  [R0603]  45.39 4.95 90 top
R16  470Ω  [R0603]  88.57 22.99 0 top
R17  100Ω  [R0603]  53.01 4.95 90 top
R18  100Ω  [R0603]  50.47 4.95 90 top
R19  75Ω  [R0603]  90.93 25.27 90 top
R20  75Ω  [R0603]  90.93 22.22 270 top
R21  150Ω  [R0603]  88.57 26.03 0 top
R22  100Ω  [R0603]  55.55 4.95 90 top
R23  1kΩ  [R0603]  73.2 27.31 90 top
R24  100Ω  [R0603]  58.09 4.95 90 top
SW1  TS-1088-AR02016  [SW-SMD_L3.9-W3.0-P4.45]  86.16 8.13 0 top
U1  RP2350B  [QFN-80_L10.0-W10.0-P0.40-TL-EP3.4]  75.36 16 180 top
U2  W25Q128JVSIQ  [SOIC-8_L5.3-W5.3-P1.27-LS8.0-BL]  81.59 3.68 90 top
U3  AMS1117-3.3  [SOT-223-3_L6.5-W3.4-P2.30-LS7.0-BR]  11.86 16.26 0 top
U4  AMS1117-1.8  [SOT-223-4_L6.5-W3.5-P2.30-LS7.0-BR]  28.63 16.26 0 top
U5  DENISE__DIP  [DIP48-6]  32.69 17.27 180 top
U6  DENISE__DIP  [DIP48-6]  32.69 14.99 180 top
USB1  TYPE-C 16PIN 2MD(073)  [USB-C-SMD_TYPE-C-6PIN-2MD-073]  70.79 5.08 0 top
X1  AFA07-S15FCA-00  [FPC-SMD_15P-P1.00_JS_AFA07-S15XXX]  94.87 14.22 90 top
X2  12MHz  [CRYSTAL-SMD_4P-L3.2-W2.5-BL]  77.78 27.43 180 top

## Footprints (pads in the part's own frame, mm; a bottom-side part is the same pattern mirrored in y, then rotated)
C0603
  rect 0.8x0.9 smd: 1(-0.7,0) 2(0.7,0)
CRYSTAL-SMD_4P-L3.2-W2.5-BL
  rect 1.4x1.2 smd: 1(-1.1,-0.85) 2(1.1,-0.85) 3(1.1,0.85) 4(-1.1,0.85)
DIP48-6
  round 1.4 hole 0.8: 1(-27.94,-7.62)
  custom 1.4x1.4 hole 0.8: 2(-25.4,-7.62) 3(-22.86,-7.62) 4(-20.32,-7.62) 5(-17.78,-7.62) 6(-15.24,-7.62) 7(-12.7,-7.62) 8(-10.16,-7.62) 9(-7.62,-7.62) 10(-5.08,-7.62) 11(-2.54,-7.62) 12(0,-7.62) 13(2.54,-7.62) 14(5.08,-7.62) 15(7.62,-7.62) 16(10.16,-7.62) 17(12.7,-7.62) 18(15.24,-7.62) 19(17.78,-7.62) 20(20.32,-7.62) 21(22.86,-7.62) 22(25.4,-7.62) 23(27.94,-7.62) 24(30.48,-7.62) 25(30.48,7.62) 26(27.94,7.62) 27(25.4,7.62) 28(22.86,7.62) 29(20.32,7.62) 30(17.78,7.62) 31(15.24,7.62) 32(12.7,7.62) 33(10.16,7.62) 34(7.62,7.62) 35(5.08,7.62) 36(2.54,7.62) 37(0,7.62) 38(-2.54,7.62) 39(-5.08,7.62) 40(-7.62,7.62) 41(-10.16,7.62) 42(-12.7,7.62) 43(-15.24,7.62) 44(-17.78,7.62) 45(-20.32,7.62) 46(-22.86,7.62) 47(-25.4,7.62) 48(-27.94,7.62)
FPC-SMD_15P-P1.00_JS_AFA07-S15XXX
  rect 0.6x2.3 smd: 1(-7,1.008) 2(-6,1.008) 3(-5,1.008) 4(-4,1.008) 5(-3,1.008) 6(-2,1.008) 7(-1,1.008) 8(0,1.008) 9(1,1.008) 10(2,1.01) 11(3,1.01) 12(4,1.01) 13(5,1.01) 14(6,1.008) 15(7,1.01)
  rect 2.6x3 smd: 16(9.352,-1.01) 17(-9.352,-1.01)
HDR-TH_3P-P2.54-V-M-1
  rect 1.575x1.8 hole 1.2: 1(-2.54,0)
  round 1.8 hole 1.2: 2(0,0) 3(2.54,0)
Pad_e38
  round 1.152 hole 1.152: 1(0,0)
Pad_e57
  round 1.152 hole 1.152: 1(0,0)
Pad_e58
  round 1.152 hole 1.152: 1(0,0)
QFN-80_L10.0-W10.0-P0.40-TL-EP3.4
  rect 0.665x0.22 smd: 1(-4.907,3.8) 2(-4.907,3.4) 3(-4.907,3) 4(-4.907,2.6) 5(-4.907,2.2) 6(-4.907,1.8) 7(-4.907,1.4) 8(-4.907,1) 9(-4.907,0.6) 10(-4.907,0.2) 11(-4.907,-0.2) 12(-4.907,-0.6) 13(-4.907,-1) 14(-4.907,-1.4) 15(-4.907,-1.8) 16(-4.907,-2.2) 17(-4.907,-2.6) 18(-4.907,-3) 19(-4.907,-3.4) 20(-4.907,-3.8) 41(4.907,-3.8) 42(4.907,-3.4) 43(4.907,-3) 44(4.907,-2.6) 45(4.907,-2.2) 46(4.907,-1.8) 47(4.907,-1.4) 48(4.907,-1) 49(4.907,-0.6) 50(4.907,-0.2) 51(4.907,0.2) 52(4.907,0.6) 53(4.907,1) 54(4.907,1.4) 55(4.907,1.8) 56(4.907,2.2) 57(4.907,2.6) 58(4.907,3) 59(4.907,3.4) 60(4.907,3.8)
  rect 0.22x0.665 smd: 21(-3.8,-4.907) 22(-3.4,-4.907) 23(-3,-4.907) 24(-2.6,-4.907) 25(-2.2,-4.907) 26(-1.8,-4.907) 27(-1.4,-4.907) 28(-1,-4.907) 29(-0.6,-4.907) 30(-0.2,-4.907) 31(0.2,-4.907) 32(0.6,-4.907) 33(1,-4.907) 34(1.4,-4.907) 35(1.8,-4.907) 36(2.2,-4.907) 37(2.6,-4.907) 38(3,-4.907) 39(3.4,-4.907) 40(3.8,-4.907) 61(3.8,4.907) 62(3.4,4.907) 63(3,4.907) 64(2.6,4.907) 65(2.2,4.907) 66(1.8,4.907) 67(1.4,4.907) 68(1,4.907) 69(0.6,4.907) 70(0.2,4.907) 71(-0.2,4.907) 72(-0.6,4.907) 73(-1,4.907) 74(-1.4,4.907) 75(-1.8,4.907) 76(-2.2,4.907) 77(-2.6,4.907) 78(-3,4.907) 79(-3.4,4.907) 80(-3.8,4.907)
  rect 3.4x3.4 smd: 81(0,0)
R0603
  rect 0.806x0.864 smd: 1(-0.753,0) 2(0.753,0)
SOIC-8_L5.3-W5.3-P1.27-LS8.0-BL
  oval 0.63x2.25 smd: 1(-1.905,-3.53) 2(-0.635,-3.53) 3(0.635,-3.53) 4(1.905,-3.53) 5(1.905,3.53) 6(0.635,3.53) 7(-0.635,3.53) 8(-1.905,3.53)
SOT-223-3_L6.5-W3.4-P2.30-LS7.0-BR
  rect 2.5x1.1 smd: 1(2.97,-2.3) 2(2.97,0) 3(2.97,2.3)
  rect 2.34x3.6 smd: 4(-2.97,0)
SOT-223-4_L6.5-W3.5-P2.30-LS7.0-BR
  rect 2.47x0.98 smd: 1(2.835,-2.3) 2(2.835,0) 3(2.835,2.3)
  rect 2.47x3.6 smd: 4(-2.835,0)
SW-SMD_L3.9-W3.0-P4.45
  rect 1.23x1.36 smd: 1(-2.185,0) 2(2.185,0)
USB-C-SMD_TYPE-C-6PIN-2MD-073
  rect 0.55x1.1 smd: 1(-3.2,2.375) 2(-2.4,2.375) 11(2.4,2.375) 12(3.2,2.375)
  rect 0.3x1.1 smd: 3(-1.75,2.375) 4(-1.25,2.375) 5(-0.75,2.375) 6(-0.25,2.375) 7(0.25,2.375) 8(0.75,2.375) 9(1.25,2.375) 10(1.75,2.375)
  oval 1.1x2 hole 0.6x1.5: 13(-4.325,1.825) 14(4.325,1.825)
  oval 1.2x1.8 hole 0.6x1.2: 13(-4.325,-2.375) 14(4.325,-2.375)

## Nets
As in the schematic.

Pads without a net: NOREF 1; NOREF#2 1; NOREF#3 1; U1 63 65; USB1 2 3 4 9 10 11; X1 5 6 11 12 13 14 15; X2 2 4

## Via types
v1: diameter 0.61, hole 0.305, Top Layer to Bottom Layer, 120 vias

## Routing (per net, layer and track width the routed paths; a pad name or vN(x,y) marks a point on that pad's centre or on a via; arc(x,y) is an arc through that point)
GND: length 48.6
  Top Layer w0.2: v1(72.77,9.77) 72.4,9.4 71.75,9.4 ; v1(73.97,8.51) 73.99,8.48 USB1.12 ; 67.59,7.45 67.59,8.15 67.24,8.51 v1(66.85,8.51) ; 71.96,12.7 U1.62
  Top Layer w0.25: X1.16 v1(97.92,23.58) ; X1.17 v1(97.92,4.87)
  Top Layer w0.4: C1.1 91.05,1.84 v1(91.11,1.91) ; U2.4 84.3,5.59 84.19,5.69 v1(84.19,6.51) 84.19,7.91 SW1.1
  Top Layer w0.5: C10.2 86.22,14.41 v1(86.29,14.48)
  Top Layer w0.6: R6.1 v1(90.93,17.62) R7.1 ; X1.7 95.49,13.22 v1(95.5,13.21) ; X1.1 v1(95.5,7.22) ; X1.10 v1(95.5,16.22) ; X1.4 v1(95.5,10.22) ; R20.1 v1(90.93,23.74) R19.1
  Top Layer w0.8: v1(64.25,13.08) C7.2 C2.1 ; v1(67.49,9.27) 67.55,9.33 C9.2 ; v1(14.83,12.7) 14.83,13.96 14.91,14.03 C16.1 ; C19.1 31.54,14.03 U4.1 31.55,13.87 v1(31.55,13.21) ; C15.2 v1(69.01,24) ; C13.2 v1(71.55,28.89) ; v1(85.27,18.8) 85.17,18.69 84.71,18.69 ; 74.86,28 v1(74.86,28.92) ; SW1.1 83.91,8.06 C12.2 ; C3.2 80.97,26.59 v1(80.97,25.72) ; C17.1 v1(19.48,13.14) ; 86.35,11.49 C6.2 ; 86.35,11.49 C5.2 ; 86.35,11.49 v1(86.41,11.43) ; C18.1 v1(37.52,14.03) ; C14.1 v1(81.08,23.85)
  vias: v1(72.84,17.14) v1(73.08,13.34) v1(75.36,13.25) v1(78.03,16.51) v1(78.03,15.11) v1(78.03,13.34)
VCC: length 7.5
  Top Layer w0.8: C18.2 36.12,19.3 ; C17.2 19.48,19.05
VCC18: length 90.4
  Top Layer w0.2: U1.10 83.51,15.8 v1(83.53,15.83) ; C10.1 85.74,15.81 86.84,14.71 86.84,13.77 85.97,12.89 C5.1 ; v1(66.39,14.81) 66.39,14.82 67.37,15.8 U1.51 ; v1(74.58,24.15) 74.76,23.97 U1.32 ; 85.27,15.94 85.21,15.88
  Top Layer w0.4: 85.16,15.83 v1(83.53,15.83)
  Top Layer w0.5: v1(66.39,14.81) 66.18,14.61 65.65,14.61 ; C13.1 72.5,25.65 73.08,25.65 v1(74.58,24.15)
  Top Layer w1: C19.2 33.52,16.26 U4.2 U4.4
  Inner2 w1: v1(74.58,24.15) 74.58,21.73 ; 74.58,21.73 80.49,15.83 v1(83.53,15.83) ; 74.58,21.73 74.58,20.81 68.59,14.81 v1(66.39,14.81) 38.09,14.81 37.91,14.99 37.12,14.99 36.95,14.81 35.02,14.81 33.58,16.26
  vias: v1(20.8,16.51) v1(20.79,14.75) v1(20.88,12.95) v1(22.53,16.51) v1(22.53,14.75) v1(22.53,13) v1(24.06,16.51) v1(24.06,15.7) v1(24.06,14.75) v1(24.82,13.97) v1(25.01,12.97) v1(25.83,13.97) v1(26.84,13.97) v1(27.42,14.75) v1(27.36,12.95) v1(29.17,15.37) v1(29.17,12.95) v1(33.33,16.51) v1(33.33,15.81) v1(33.96,16.51)
VCC33: length 57.9
  Top Layer w0.2: 71.56,10.55 U1.61 ; 71.56,10.55 71.3,10.29 v1(70.79,10.29) ; 71.56,10.55 71.83,10.29 72.57,10.29 72.76,10.48 U1.64 72.75,11.11 72.75,11.74 72.82,11.81 74.39,11.81 ; U1.60 69.77,12.2 69.55,12.42 ; C15.1 69.01,20.07 69.28,19.8 U1.41 ; C6.1 88.33,12.89 88.64,12.58 R1.2 ; U1.76 v1(77.56,11.94) ; R9.2 v1(93.47,26.03) ; U1.59 69.74,12.6 69.55,12.42 ; v1(66.48,15.95) 67.02,15.95 67.28,16.2 U1.50 ; 69.55,12.42 v1(68.98,12.42) ; v1(82.07,18.01) 81.86,17.8 U1.15 ; 74.39,11.81 74.36,11.78 U1.68 ; 74.39,11.81 74.6,11.81 74.76,11.65 U1.69 ; v1(78.45,23.29) 78.29,23.12 78.29,21.98 77.96,21.66 U1.24 77.96,20.38 77.78,20.19 76.25,20.19 75.96,20.48 U1.29
  Top Layer w0.216: v1(82.7,13.22) 82.73,13.24 82.73,13.3 82.18,13.85 81.71,13.85 81.66,13.8 U1.5 ; v1(72.18,24.33) 72.18,24.26 73.09,23.35 73.1,23.35 73.56,22.88 U1.35
  Top Layer w0.25: C11.2 70.79,9.84 v1(70.79,10.29)
  Top Layer w0.4: C12.1 v1(83.49,9.46) ; C6.1 v1(87.56,13.84) ; C1.2 90.54,3.24 v1(90.86,3.56) ; U2.8 80.19,1.78 v1(80.32,1.65)
  Top Layer w0.5: C9.1 68.63,12.06 v1(68.98,12.42) ; 65.65,16.26 66.17,16.26 v1(66.48,15.95) ; v1(82.07,18.01) 82.57,18.01 83.06,18.5 83.06,18.66
  Top Layer w0.8: v1(69.92,21.82) 69.76,21.65 C15.1 ; v1(78.45,23.29) 78.45,23.47 C14.2 ; v1(16.69,16.26) 16.44,16.01 v1(16.44,15.43) 16.74,15.73 17.21,15.73
  Top Layer w1: U3.4 v1(16.69,16.26) ; C16.2 17.51,15.43 17.21,15.73
  vias: v1(1.96,16.51) v1(1.95,14.07) v1(1.96,11.64) v1(4.62,16.51) v1(4.62,14.07) v1(4.62,11.62) v1(6.91,11.56) v1(7.23,16.38) v1(7.23,15.53) v1(7.23,14.66) v1(8.05,13.84) v1(8.94,13.84) v1(9.07,11.56) v1(9.77,13.84) v1(10.47,14.73) v1(12.5,15.41) v1(12.5,13.59) v1(12.5,11.56)
7M: length 66.4
  Top Layer w0.2: v1(44.52,19.21) 44.67,19.06 44.67,14.27 41.98,11.58 28.52,11.58 27.61,10.67 U5.35
  Top Layer w0.216: v1(80.06,21.97) 79.8,22.24 79.17,22.24 79.02,22.08 79.02,21.68 78.76,21.43 U1.22 ; U5.35 U6.35
  Bottom Layer w0.216: v1(80.06,21.97) 79.76,21.97 78.81,21.02 78.81,20.32 77.9,19.41 44.72,19.41 v1(44.52,19.21)
B0: length 103.8
  Top Layer w0.2: U1.6 80.35,14.2 80.35,14.21 82.5,14.21 83.26,13.45 83.26,12.56 v1(82.83,12.13)
  Top Layer w0.254: U6.24 U5.24
  Bottom Layer w0.2: 82.86,12.06 82.86,12.39 83.26,12.8 83.26,13.45 82.87,13.84 81.07,13.84 80.06,12.82 80.06,8.74 79.16,7.85 77.15,7.85 76.17,8.83 76.17,10.15 75.61,10.71 72.48,10.71 70.6,12.6 70.6,15.73 69.48,16.85 46.87,16.85 46.47,16.44 43.29,16.44 41.43,18.31 21.7,18.31 20.68,19.32 5.5,19.32 U6.24
B1: length 99.3
  Top Layer w0.216: v1(84.29,11.98) 83.69,12.58 83.69,13.55 82.64,14.6 U1.7
  Top Layer w0.254: U5.25 U6.25
  Bottom Layer w0.2: U6.25 6.28,3.3 63.3,3.3 65.59,1.02 76.91,1.02 82.6,6.71 82.6,9.93 84.09,11.41 84.09,11.77 v1(84.29,11.98)
B2: length 96.6
  Top Layer w0.216: U1.8 82.76,15 84.25,13.51 v1(84.25,13.16)
  Top Layer w0.254: 4.75,9.65 4.75,7.37
  Bottom Layer w0.2: 4.75,7.37 8.46,3.65 63.44,3.65 65.73,1.37 76.76,1.37 82.25,6.85 82.25,10.07 83.74,11.56 83.74,12.28 84.05,12.59 84.05,12.96 v1(84.25,13.16)
B3: length 92.3
  Top Layer w0.2: U1.9 83.16,15.4 v1(84.27,14.29)
  Top Layer w0.254: U5.27 U6.27
  Bottom Layer w0.2: v1(84.27,14.29) 83.7,13.72 83.7,12.74 83.38,12.42 83.38,11.7 81.9,10.22 81.9,7 78.9,4.01 10.65,4.01 U6.27
BLANK: length 75.1
  Top Layer w0.216: v1(79.81,22.86) 79.28,22.86 78.65,22.23 78.65,21.83 78.36,21.55 U1.23 ; 19.99,7.37 19.99,11.05 21.23,12.29 41.68,12.29 43.49,14.1 v1(43.49,19.58)
  Bottom Layer w0.216: v1(79.81,22.86) 79.81,22.54 78.44,21.17 78.44,20.47 77.74,19.78 43.69,19.78 v1(43.49,19.58)
BURST: length 2.3
  Top Layer w0.216: 17.45,24.89 17.45,22.61
CCK: length 63.6
  Top Layer w0.2: v1(45.23,18.85) 45.23,14.33 42.12,11.23 30.71,11.23 30.15,10.67 30.15,9.65
  Top Layer w0.216: 30.15,7.37 30.15,9.65 ; 79.16,20.91 79.16,21.31 79.35,21.49 79.75,21.49 79.83,21.41 80.3,21.41 80.38,21.49 v1(80.82,21.49)
  Bottom Layer w0.216: v1(80.82,21.49) 80.61,21.27 79.75,21.27 79.17,20.7 79.17,20.17 78.04,19.03 45.41,19.03 v1(45.23,18.85)
CDAC: length 70.5
  Top Layer w0.2: v1(81.97,21.46) 81.84,21.46 81.21,20.83 81.21,20.28 80.72,19.8 U1.20 ; v1(44.06,18.55) 44.12,18.49 44.12,14.22 41.83,11.93 26.32,11.93 25.07,10.69 U5.34
  Top Layer w0.216: U6.34 U5.34
  Bottom Layer w0.2: v1(81.97,21.46) 81.59,21.46 81.04,20.91 80.02,20.91 79.53,20.43 79.53,20.02 78.19,18.67 45.9,18.67 45.51,18.29 44.32,18.29 v1(44.06,18.55)
CSI0_N: length 16
  Top Layer w0.2: R4.2 89.46,18.42 89.98,17.9 89.98,16.35 89.97,16.34 89.97,16.01 R3.2 ; X1.2 93.83,8.25 91.95,8.25 91.29,8.91 91.29,15.02 R7.2 90.92,15.37 R3.2 ; R1.1 89.28,15.32 R3.2
CSI0_P: length 18.3
  Top Layer w0.2: X1.3 92.12,9.22 91.65,9.7 91.65,19.22 R6.2 90.92,19.94 R8.2 88.57,19.19 88.57,17.53 89.21,16.89 R5.2
CSI_CLK_N: length 124.6
  Top Layer w0.2: v1(92.2,14.22) 93.85,14.22 X1.8 ; R9.1 92.58,22.73 92.45,22.6 v1(92.06,22.6) 92.06,21.83 91.7,21.47 R20.2 90.92,21.46 R10.2 89.98,22.12 89.98,23.52 89.97,23.53 89.97,23.88 89.33,24.51 R11.2
  Bottom Layer w0.25: v1(92.2,14.22) 92.76,14.22 93.13,14.58 95.72,14.58 96.52,13.78 96.52,11.26 96.93,10.85 97.97,10.85 98.42,11.29 98.42,20.33 97.39,21.36 90.64,21.36 89.9,20.61 89.9,10.76 90.52,10.13 93.86,10.13 94.03,9.95 94.03,8.78 93.86,8.6 91.2,8.6 90.78,8.19 90.78,6.12 91.39,5.51 96.09,5.51 96.63,4.97 96.63,3.21 96.3,2.89 87.47,2.89 87.15,3.21 87.15,4.59 87.33,4.77 89.2,4.77 89.61,5.18 89.61,6.68 89.2,7.1 87.85,7.1 86.74,8.21 85.34,8.21 85.16,8.38 85.16,9.55 85.34,9.73 86.74,9.73 88.54,11.53 88.54,14.56 86.75,16.35 86.75,18.94 86.93,19.11 88.43,19.11 88.85,19.52 88.85,21.03 88.43,21.44 86.93,21.44 86.75,21.62 86.75,22.79 86.93,22.96 88.43,22.96 88.85,23.38 88.85,24.88 88.43,25.29 86.93,25.29 86.75,25.47 86.75,25.98 87.03,26.27 88.99,26.27 89.51,25.74 89.51,23.52 90.26,22.78 90.5,22.78 90.52,22.75 91.35,22.75 91.51,22.6 v1(92.06,22.6)
CSI_CLK_P: length 123.3
  Top Layer w0.2: X1.9 93.84,15.24 v1(92.2,15.24) ; v1(92.01,23.36) 91.82,23.55 91.82,25.14 R19.2 90.92,26.03 R21.2 89.33,26.03 88.57,25.27 88.57,23.74 R16.2
  Bottom Layer w0.25: v1(92.2,15.24) 92.76,15.24 93.01,14.99 95.88,14.99 96.92,13.95 96.92,11.43 97.1,11.25 97.81,11.25 98.01,11.46 98.01,20.16 97.22,20.95 90.81,20.95 90.3,20.45 90.3,10.92 90.69,10.53 94.02,10.53 94.44,10.12 94.44,8.61 94.02,8.2 91.36,8.2 91.19,8.02 91.19,6.28 91.56,5.91 96.26,5.91 97.03,5.14 97.03,3.05 96.47,2.49 87.3,2.49 86.75,3.04 86.75,4.76 87.16,5.17 89.03,5.17 89.21,5.35 89.21,6.52 89.03,6.69 87.68,6.69 86.57,7.8 85.17,7.8 84.76,8.22 84.76,9.72 85.17,10.13 86.57,10.13 88.14,11.7 88.14,14.39 86.35,16.18 86.35,19.1 86.76,19.51 88.27,19.51 88.44,19.69 88.44,20.86 88.27,21.04 86.76,21.04 86.35,21.45 86.35,22.95 86.76,23.37 88.27,23.37 88.44,23.54 88.44,24.71 88.27,24.89 86.76,24.89 86.35,25.3 86.35,26.15 86.87,26.67 89.15,26.67 89.92,25.91 89.92,23.69 90.42,23.18 90.67,23.18 90.69,23.16 91.17,23.16 91.2,23.18 91.27,23.18 91.45,23.36 v1(92.01,23.36)
DRD0: length 34.6
  Top Layer w0.216: U1.40 71.56,22.04 69.97,23.63 69.97,24.14 66.35,27.76 46.23,27.76 45.39,26.92 U5.7
  Top Layer w0.254: U5.7 U6.7
DRD1: length 33.7
  Top Layer w0.216: 47.93,24.89 47.93,27.05 48.28,27.39 66.2,27.39 67.82,25.77 67.82,20.13 68.55,19.4 70.41,19.4
  Top Layer w0.254: 47.93,24.89 47.93,22.61
DRD2: length 30.6
  Top Layer w0.216: 70.41,19 68.43,19 67.45,19.98 67.45,25.62 66.04,27.03 51.08,27.03 50.47,26.42 U5.5
  Top Layer w0.254: U5.5 U6.5
DRD3: length 27.8
  Top Layer w0.216: 70.41,18.6 68.31,18.6 67.08,19.82 67.08,25.46 65.89,26.66 53.51,26.66 53.01,26.16 U5.4
  Top Layer w0.254: U6.4 U5.4
DRD4: length 25
  Top Layer w0.216: 55.55,24.89 55.55,25.91 55.93,26.29 65.74,26.29 66.72,25.31 66.72,19.67 68.19,18.2 70.41,18.2
  Top Layer w0.254: 55.55,22.61 55.55,24.89
DRD5: length 21.7
  Top Layer w0.216: 58.09,24.89 59.11,25.91 65.6,25.91 66.35,25.16 66.35,19.52 68.06,17.8 70.41,17.8
  Top Layer w0.254: 58.09,24.89 58.09,22.61
DRD6: length 17.8
  Top Layer w0.216: U5.1 64.95,24.89 65.98,23.86 65.98,19.29 67.87,17.4 70.41,17.4
  Top Layer w0.305: U5.1 U6.1
DRD7: length 18.9
  Top Layer w0.2: U1.48 67.63,17 67.14,17.5 62.76,17.5
  Top Layer w0.216: U5.48 61.41,10.43 61.41,16.15 62.76,17.5
  Top Layer w0.254: U6.48 U5.48
DRD8: length 3.9
  Top Layer w0.216: R24.2 58.09,7.37
  Top Layer w0.254: 58.09,9.65 58.09,7.37
DRD9: length 3.9
  Top Layer w0.216: 55.55,7.37 R22.2
  Top Layer w0.254: 55.55,9.65 55.55,7.37
DRD10: length 3.9
  Top Layer w0.216: R17.2 U6.45
  Top Layer w0.254: U5.45 U6.45
DRD11: length 3.9
  Top Layer w0.216: U6.44 R18.2
  Top Layer w0.254: U5.44 U6.44
DRD12: length 4
  Top Layer w0.216: 47.93,7.37 R14.2
  Top Layer w0.254: 47.93,7.37 47.93,9.65 47.92,9.67
DRD13: length 3.9
  Top Layer w0.216: U6.42 R15.2
  Top Layer w0.254: U5.42 U6.42
DRD14: length 3.9
  Top Layer w0.216: R12.2 U6.41
  Top Layer w0.254: U5.41 U6.41
DRD15: length 3.9
  Top Layer w0.216: R13.2 40.31,7.37
  Top Layer w0.254: 40.31,9.65 40.31,7.37
G0: length 82.7
  Top Layer w0.216: U1.1 80.94,12.2 81.49,11.66 81.49,11.37 v1(81.86,11)
  Top Layer w0.254: 9.83,9.65 9.83,7.37
  Bottom Layer w0.216: 9.83,7.37 12.83,4.37 78.75,4.37 81.54,7.15 81.54,10.87 81.66,11 v1(81.86,11)
G1: length 80.5
  Top Layer w0.216: U1.2 81.18,12.6 82.02,11.76 v1(82.05,11.76)
  Top Layer w0.254: 12.37,9.65 12.37,7.37
  Bottom Layer w0.216: 12.37,7.37 15,4.74 78.6,4.74 81.17,7.3 81.17,11.39 81.53,11.76 v1(82.05,11.76)
G2: length 78.3
  Top Layer w0.216: v1(82.14,12.52) 82.09,12.47 81.96,12.47 81.43,13 U1.3
  Top Layer w0.254: 14.91,9.65 14.91,7.37
  Bottom Layer w0.216: v1(82.14,12.52) 81.28,12.52 80.8,12.04 80.8,7.45 78.45,5.1 17.17,5.1 14.91,7.37
G3: length 75.5
  Top Layer w0.216: v1(81.94,13.28) 81.82,13.4 U1.4
  Top Layer w0.254: 17.45,9.65 17.45,7.37
  Bottom Layer w0.216: 17.45,7.37 19.35,5.47 78.3,5.47 80.43,7.61 80.43,12.69 81.03,13.28 v1(81.94,13.28)
M0H: length 2.3
  Top Layer w0.254: 40.31,24.89 40.31,22.61
M0V: length 2.3
  Top Layer w0.254: U5.38 U6.38
M1H: length 2.3
  Top Layer w0.254: U5.8 U6.8
M1V: length 2.3
  Top Layer w0.254: 37.77,9.65 37.77,7.37
PIXELS: length 2.3
  Top Layer w0.216: 22.53,9.65 22.53,7.37
R0: length 77
  Top Layer w0.216: v1(77.95,9.8) 77.96,9.82 U1.77
  Top Layer w0.254: 12.37,24.89 12.37,22.61
  Bottom Layer w0.216: 12.37,22.61 14.17,20.81 21.27,20.81 22.3,19.78 42.03,19.78 43.9,17.91 45.77,17.91 46.17,18.31 70.09,18.31 72.06,16.34 72.06,13.21 73.09,12.18 76.22,12.18 77.95,10.45 v1(77.95,9.8)
R1: length 81.2
  Top Layer w0.216: U1.78 78.36,10.28 78.54,10.11 78.54,9.4 78.37,9.23 v1(78.37,9.14)
  Top Layer w0.254: 9.83,24.89 9.83,22.61
  Bottom Layer w0.216: 9.83,22.61 12,20.44 21.12,20.44 22.14,19.41 41.88,19.41 43.75,17.54 45.97,17.54 46.37,17.94 69.93,17.94 71.69,16.18 71.69,13.06 72.94,11.81 76.07,11.81 77.27,10.61 77.27,9.65 77.78,9.14 v1(78.37,9.14)
R2: length 85.4
  Top Layer w0.216: v1(79.13,9.43) 79.08,9.43 78.93,9.58 78.93,10.23 78.76,10.4 U1.79
  Top Layer w0.254: U6.22 U5.22
  Bottom Layer w0.216: U6.22 9.85,20.05 20.99,20.05 21.99,19.04 41.72,19.04 43.6,17.17 46.12,17.17 46.53,17.58 69.78,17.58 71.33,16.03 71.33,12.9 72.79,11.44 75.91,11.44 76.9,10.46 76.9,9.13 77.45,8.58 78.86,8.58 79.13,8.85 v1(79.13,9.43)
R3: length 88.9
  Top Layer w0.216: 79.16,11.09 79.16,10.54 79.42,10.29 v1(79.5,10.29)
  Top Layer w0.254: 4.75,22.61 4.75,24.89
  Bottom Layer w0.216: 4.75,22.61 7.68,19.68 20.83,19.68 21.85,18.67 41.58,18.67 43.44,16.8 46.32,16.8 46.72,17.21 69.63,17.21 70.96,15.88 70.96,12.75 72.63,11.07 75.76,11.07 76.53,10.3 76.53,8.98 77.3,8.21 79.02,8.21 79.69,8.89 79.69,10.09 v1(79.5,10.29)
RGA1: length 63.7
  Top Layer w0.216: U1.25 77.56,22.05 v1(77.73,22.21)
  Top Layer w0.254: 19.99,24.89 19.99,22.61
  Bottom Layer w0.216: v1(77.73,22.21) 77.73,21.52 76.36,20.15 22.45,20.15 19.99,22.61
RGA2: length 61.8
  Top Layer w0.216: v1(77.33,22.95) 77.16,22.78 77.16,20.91
  Top Layer w0.254: 22.53,24.89 22.53,22.61
  Bottom Layer w0.216: v1(77.33,22.95) 77.14,22.76 77.14,21.45 76.21,20.52 24.62,20.52 22.53,22.61
RGA3: length 59.9
  Top Layer w0.216: v1(76.95,23.65) 76.76,23.46 U1.27
  Top Layer w0.254: U5.15 U6.15
  Bottom Layer w0.216: U6.15 26.79,20.88 76.06,20.88 76.76,21.59 76.76,23.46 v1(76.95,23.65)
RGA4: length 57.9
  Top Layer w0.216: v1(76.43,24.21) 76.36,24.14 U1.28
  Top Layer w0.254: U5.14 U6.14
  Bottom Layer w0.216: v1(76.43,24.21) 76.38,24.16 76.38,21.84 75.79,21.25 28.33,21.25 27.61,21.97 U6.14
RGA5: length 53
  Top Layer w0.216: 73.16,20.91 73.16,22.52 71.45,24.24 71.45,24.76 66.97,29.24 32.46,29.24 30.15,26.92 30.15,24.89
  Top Layer w0.254: 30.15,24.89 30.15,22.61
RGA6: length 49.9
  Top Layer w0.216: U5.12 32.69,27.31 34.25,28.87 66.82,28.87 71.08,24.61 71.08,24.09 72.76,22.4 U1.37
  Top Layer w0.254: U5.12 U6.12
RGA7: length 46.6
  Top Layer w0.216: U5.11 35.23,27.31 36.43,28.5 66.67,28.5 70.53,24.63 70.53,24.62 70.71,24.44 70.71,23.93 72.36,22.28 U1.38
  Top Layer w0.254: U6.11 U5.11
RGA8: length 43.2
  Top Layer w0.216: 37.77,24.89 37.77,27.18 38.72,28.13 66.5,28.13 70.34,24.29 70.34,23.78 71.96,22.16 U1.39
  Top Layer w0.254: 37.77,24.89 37.77,22.61
SWCLK: length 15.6
  Top Layer w0.2: U1.33 74.36,23.58 73.68,24.27 v1(73.47,24.27)
  Bottom Layer w0.25: 83.75,21.97 82.86,22.86 80.95,22.86 78.92,24.89 74.09,24.89 v1(73.47,24.27)
SWDIO: length 16.9
  Top Layer w0.2: v1(72.82,24.77) 72.82,24.51 72.91,24.42 72.91,24.03 73.24,23.71 73.63,23.71 73.96,23.37 U1.34
  Bottom Layer w0.25: 83.75,27.05 83.75,26.92 81.59,24.77 79.62,24.77 79.09,25.29 73.67,25.29 73.14,24.77 v1(72.82,24.77)
USB_DM: length 7.2
  Top Layer w0.2: 71.04,8.25 71.43,8.64 72.7,8.64 73.56,9.5 U1.66 ; 71.04,8.25 USB1.7 ; 71.04,8.25 70.8,8.25 70.8,8.26 70.29,8.26 70.28,8.25 70.15,8.25 70.03,8.13 70.03,7.47 USB1.5
USB_DP: length 7.9
  Top Layer w0.2: USB1.6 70.54,6.73 70.66,6.6 71.43,6.6 71.55,6.73 71.55,7.44 USB1.8 71.54,8.15 71.68,8.28 72.84,8.28 73.96,9.4 U1.67
$1N6285: length 31.2
  Top Layer w0.216: 70.41,14.2 68.14,14.2 64.13,10.19 64.13,4.86 61.7,2.43 49.7,2.43 R14.1
$1N6288: length 28.5
  Top Layer w0.216: R18.1 51.87,2.8 61.55,2.8 63.76,5.01 63.76,10.34 68.02,14.6 70.41,14.6
$1N6291: length 25.9
  Top Layer w0.216: R17.1 54.04,3.17 61.4,3.17 63.39,5.16 63.39,10.5 67.9,15 70.41,15
$1N6294: length 23.2
  Top Layer w0.216: 70.41,15.4 67.78,15.4 63.02,10.65 63.02,5.31 61.25,3.54 56.22,3.54 R22.1
$1N6300: length 36.6
  Top Layer w0.216: 70.41,13.4 68.38,13.4 64.87,9.88 64.87,4.55 62.01,1.7 45.36,1.7 R12.1
$1N6303: length 33.9
  Top Layer w0.216: R15.1 47.53,2.06 61.86,2.06 64.5,4.7 64.5,10.04 68.26,13.8 70.41,13.8
$1N6306: length 39.2
  Top Layer w0.216: 70.41,13 68.5,13 65.23,9.73 65.23,4.4 62.16,1.33 43.19,1.33 R13.1
$1N7209: length 24.4
  Top Layer w0.2: R24.1 58.22,4.2 58.42,4 61.12,4 62.66,5.54 62.66,10.8 62.69,10.82 62.69,16.23 63.6,17.14 66.99,17.14 67.53,16.6 U1.49
$1N7218: length 8.9
  Top Layer w0.2: R3.1 87.8,15.35 86.81,15.35 86.67,15.49 86.67,16.38 86.29,16.76 83.62,16.76 83.06,16.2 U1.11
$1N7223: length 7.9
  Top Layer w0.2: R5.1 87.75,16.82 86.86,16.82 86.57,17.12 83.47,17.12 82.96,16.6 U1.12
$1N7228: length 8.3
  Top Layer w0.2: R4.1 87.17,18.42 86.92,18.16 86.92,17.88 86.51,17.47 83.33,17.47 82.86,17 U1.13
$1N7233: length 9.5
  Top Layer w0.2: U1.14 82.76,17.4 83.18,17.82 86.33,17.82 86.54,18.03 86.54,19.56 86.92,19.94 R8.1
$1N7238: length 9.3
  Top Layer w0.2: U1.16 81.12,18.2 82.37,19.45 85.36,19.45 86.49,20.58 86.49,21.2 86.76,21.46 R10.1
$1N7248: length 11.6
  Top Layer w0.2: R11.1 86.43,24.51 85.79,23.87 85.79,20.87 85.07,20.15 82.07,20.15 80.92,19 U1.18
$1N7253: length 12.7
  Top Layer w0.2: R21.1 86.29,26.03 85.35,25.1 85.35,20.93 84.92,20.51 81.93,20.51 80.82,19.4 U1.19
$1N7405: length 8.4
  Top Layer w0.2: U2.6 77.11,4.32 76.48,4.95 76.48,8.25 75.56,9.17 U1.71
$1N7416: length 20.2
  Top Layer w0.2: 87.05,2.03 87.29,1.79 R2.1 ; 87.05,2.03 86.79,1.78 U2.1 ; 87.05,2.03 87.05,4.57 86.67,4.95 81.57,4.95 79.61,6.91 78.66,6.91 78.01,7.56 78.01,8.71 77.16,9.56 77.16,11.09
$1N7425: length 14.4
  Top Layer w0.2: U2.2 81.21,3.05 80.29,3.97 80.29,5.73 79.46,6.56 78.51,6.56 77.66,7.41 77.66,8.56 76.76,9.46 U1.74
$1N7453: length 13.1
  Top Layer w0.2: U1.30 75.56,24.81 76.18,25.43 79.81,25.43 79.95,25.57 79.95,27.43 ; 80.95,28 80.51,28 79.95,27.45 79.95,27.43 ; 79.95,27.43 79.1,28.28 X2.1
$1N8305: length 6.9
  Top Layer w0.2: U2.5 77.21,5.59 76.83,5.97 76.83,8.4 75.96,9.27 U1.72
$1N8365: length 10
  Top Layer w0.2: 75.16,11.09 75.16,9.07 76.13,8.11 76.13,3.68 76.76,3.05 U2.7
$1N8373: length 19.6
  Top Layer w0.2: U2.3 86.3,4.32 86.55,4.06 86.55,2.55 86.41,2.41 81.34,2.41 79.94,3.82 79.94,5.59 79.32,6.21 78.37,6.21 77.31,7.26 77.31,8.42 76.36,9.36 U1.73
$1N9901: length 6.5
  Top Layer w0.2: R23.1 75.16,24.59 75.16,20.91
$1N9909: length 4.1
  Top Layer w0.2: R23.2 73.4,28.06 C4.1 76.65,26.61 X2.3
$1N12175: length 4.9
  Top Layer w0.2: R2.2 88.44,8.03 SW1.2
$1N13618: length 10.3
  Top Layer w0.2: R16.1 86.79,22.99 86.14,22.33 86.14,20.73 85.22,19.8 82.22,19.8 81.02,18.6 U1.17

## Copper pours and planes (outline as drawn; the poured copper is in the pictures)
GND on Top Layer: 71.34,19.65 79.17,19.65 79.17,12.19 71.34,12.19
GND on Bottom Layer: 71.3,20.91 80.76,20.91 80.76,11.68 71.3,11.68
GND on Inner1: 0,29.9 104.45,29.84 104.32,-0.26 0,0.07
VCC on Top Layer: 13.54,26.29 16.44,26.29 16.44,21.46 36.63,21.46 36.63,18.42 13.54,18.42
VCC18 on Top Layer: 20.5,18.03 29.52,18.03 29.52,12.7 20.5,12.7
VCC18 on Bottom Layer: 30.26,17.82 41.26,17.82 41.26,11.18 30.26,11.18
VCC18 on Bottom Layer: 20.12,17.82 30.91,17.82 30.91,11.18 20.12,11.18
VCC18 on Inner2: 20.5,17.82 29.52,17.82 29.52,12.7 20.5,12.7
VCC18 on Inner2: 29.39,16.8 35.36,16.8 35.36,13.97 29.39,13.97
VCC33 on Top Layer: 1.7,21.21 12.75,21.21 12.75,11.3 1.7,11.3
VCC33 on Bottom Layer: 1.45,18.87 14.15,18.87 14.15,11.18 1.45,11.18
VCC33 on Bottom Layer: 13.88,18.87 19.48,18.87 19.48,11.18 13.88,11.18
VCC33 on Inner2: 104.03,-0.15 104.45,29.84 0,29.9 0,0.07

Small or netless copper shapes (teardrops, artwork), in the pictures only: 245 on Top Layer, 29 on Bottom Layer

## Text on the board
Bottom Silkscreen Layer: A passion project. / Commercial use? / Please support me: / paypal.me/ClaudeSchwarz1337 | My signal on the line, / needs to waste a little time. / Through the trace it has to wiggle, / for an 833ps jiggle.
Top Solder Mask Layer: Framethrower / OCS/ECS / Revision 1.0
